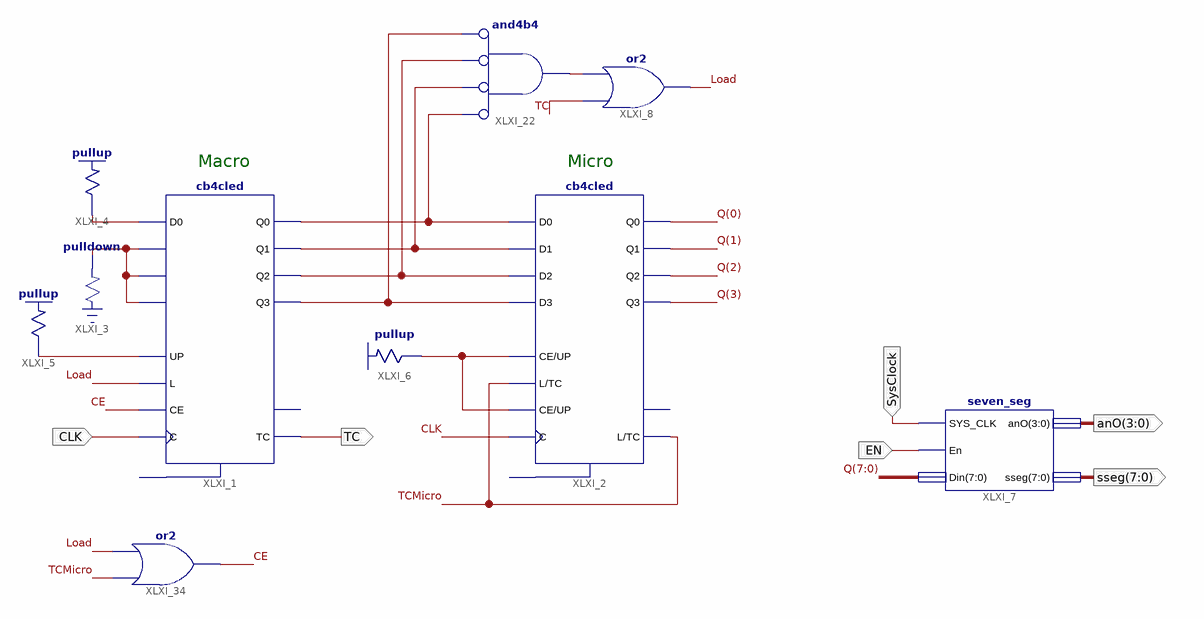
[diagram p0: schematic sheet 1]
// Xilinx ISE schematic Exp.sch (spartan3e) as structural Verilog: 10 symbols, 6 ports
module Exp (
  input  CLK,
  input  SysClock,
  input  EN,
  output [3:0] anO,
  output [7:0] sseg,
  output TC
);

  wire CE, Load, TCMicro, XLXN_2, XLXN_7, XLXN_9, XLXN_10, XLXN_26, XLXN_28, XLXN_62, XLXN_64, XLXN_65;
  wire [7:0] Q;

  cb4cled XLXI_1 (
    .C(CLK), .CE(CE), .D0(XLXN_7), .D1(XLXN_9), .D2(XLXN_9), .D3(XLXN_9), .L(Load), .UP(XLXN_10),
    .Q0(XLXN_62), .Q1(XLXN_2), .Q2(XLXN_64), .Q3(XLXN_65), .TC(TC));  // open: CLR, CEO
  cb4cled XLXI_2 (
    .C(CLK), .CE(XLXN_26), .D0(XLXN_62), .D1(XLXN_2), .D2(XLXN_64), .D3(XLXN_65), .L(TCMicro), .UP(XLXN_26),
    .Q0(Q[0]), .Q1(Q[1]), .Q2(Q[2]), .Q3(Q[3]), .TC(TCMicro));  // open: CLR, CEO
  \pulldown  XLXI_3 (.O(XLXN_9));
  \pullup  XLXI_4 (.O(XLXN_7));
  \pullup  XLXI_5 (.O(XLXN_10));
  \pullup  XLXI_6 (.O(XLXN_26));
  seven_seg XLXI_7 (.SYS_CLK(SysClock), .En(EN), .Din(Q), .anO(anO), .sseg(sseg));
  or XLXI_8 (Load, TC, XLXN_28);
  and XLXI_22 (XLXN_28, ~XLXN_62, ~XLXN_2, ~XLXN_64, ~XLXN_65);  // and4b4
  or XLXI_34 (CE, TCMicro, Load);

  // Notes on the sheet:
  //   Macro
  //   Micro
endmodule
